# Altium schematic sheet armshematic.SchDoc
size A
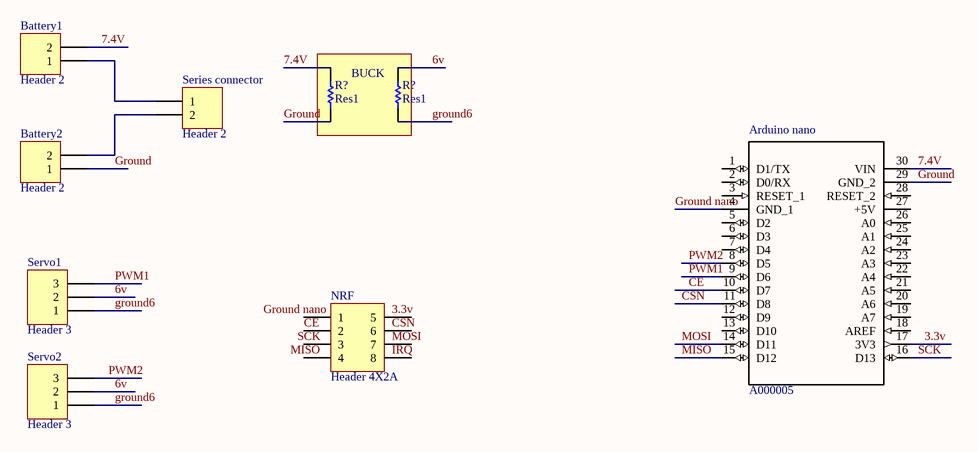
[diagram p0: armshematic.SchDoc]

## Parts
(Parts that share a designator on the sheet are numbered #1, #2 ... from top to bottom, then left to right.)
Arduino_nano  A000005  [*ARDUINO_A000005]
Battery1  Header 2  [HDR1X2]
Battery2  Header 2  [HDR1X2]
NRF  Header 4X2A  [HDR2X4_CEN]
R?#1  Res1  [AXIAL-0.3]
R?#2  Res1  [AXIAL-0.3]
Series_connector  Header 2  [HDR1X2]
Servo1  Header 3  [HDR1X3]
Servo2  Header 3  [HDR1X3]

## Blocks framed on the sheet
BUCK: R?#1 R?#2

## Nets
3.3v: Arduino_nano.17(3V3)
6v: R?#2.2 Servo1.2 Servo2.2
7.4V: Arduino_nano.30(VIN) Battery1.2 R?#1.2
CE: Arduino_nano.10(D7) NRF.2
CSN: Arduino_nano.11(D8)
Ground: Arduino_nano.29(GND_2) Battery2.1 R?#1.1
ground6: R?#2.1 Servo1.1 Servo2.1
Ground nano: Arduino_nano.4(GND_1)
MISO: Arduino_nano.15(D12)
MOSI: Arduino_nano.14(D11)
PWM1: Arduino_nano.9(D6) Servo1.3
PWM2: Arduino_nano.8(D5) Servo2.3
SCK: Arduino_nano.16(D13)
NetBattery1_1: Battery1.1 Series_connector.1
NetBattery2_2: Battery2.2 Series_connector.2

Not connected (* = marked no-connect by the designer): Arduino_nano 1(D1/TX) 2(D0/RX) 3(RESET_1) 5(D2) 6(D3) 7(D4) 12(D9) 13(D10) 18(AREF) 19(A7) 20(A6) 21(A5) 22(A4) 23(A3) 24(A2) 25(A1) 26(A0) 27(+5V) 28(RESET_2); NRF 1 3 4 5 6 7 8

## Notes on the sheet
- Labels drawn without touching a wire or pin: 3.3v, CSN, Ground nano, IRQ, MISO, MOSI, SCK

## Library data of the parts
Arduino_nano = A000005: MICRO, ARDUINO NANO 3.0, MINI-B USB, ATmega328, 0.1DIP, ICSP HDR; Package: None; Digi-Key_Part_Number: 1050-1001-ND; MP: A000005; Digi-Key_Purchase_URL: https://www.digikey.lk/product-detail/en/arduino/A000005/1050-1001-ND/2638989?utm_source=snapeda&utm_medium=aggregator&utm_campaign=symbol; MF: Arduino; SnapEDA_Link: https://www.snapeda.com/parts/A000005/Arduino/view-part/?ref=snap; Value: *
Battery1 Battery2 Series_connector = Header 2: Header, 2-Pin; LatestRevisionDate: 17-Jul-2002; LatestRevisionNote: Re-released for DXP Platform.; Publisher: Altium Limited
NRF = Header 4X2A: Header, 4-Pin, Dual row; LatestRevisionDate: 17-Jul-2002; LatestRevisionNote: Re-released for DXP Platform.; Publisher: Altium Limited
R?#1 R?#2 = Res1: Resistor; Published: 8-Jun-2000; LatestRevisionDate: 17-Jul-2002; LatestRevisionNote: Re-released for DXP Platform.; PackageReference: AXIAL-0.3; Publisher: Altium Limited; PackageDescription: Axial Device, Thru-Hole; 2 Leads; 0.3 in Pin Spacing
Servo1 Servo2 = Header 3: Header, 3-Pin; LatestRevisionDate: 17-Jul-2002; LatestRevisionNote: Re-released for DXP Platform.; Publisher: Altium Limited